# Altium schematic sheet Test_Points.SchDoc: Test Points
size A4; DocumentNumber: 22; SheetNumber: 22; SheetTotal: 51
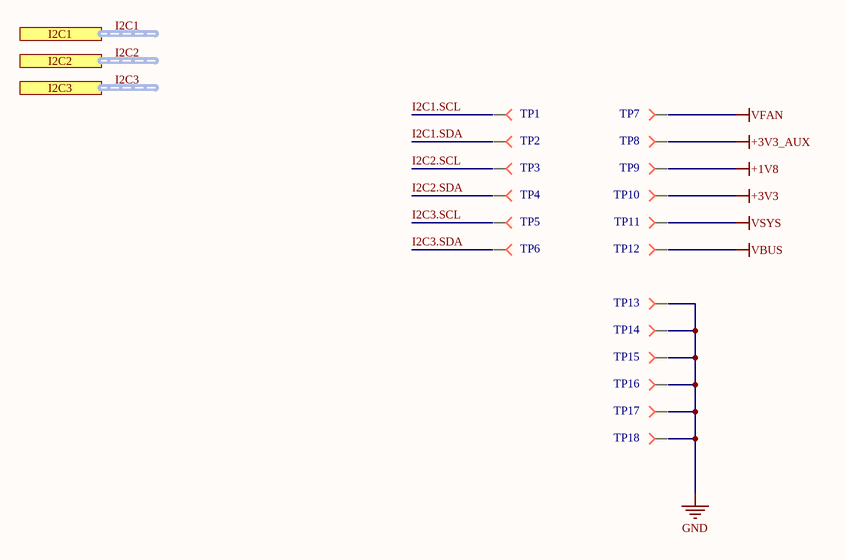
[diagram p0: Test_Points.SchDoc]

## Parts
TP1  Test Point Pad  [Testpoint]  (value not drawn)  (no BOM)
TP2  Test Point Pad  [Testpoint]  (value not drawn)  (no BOM)
TP3  Test Point Pad  [Testpoint]  (value not drawn)  (no BOM)
TP4  Test Point Pad  [Testpoint]  (value not drawn)  (no BOM)
TP5  Test Point Pad  [Testpoint]  (value not drawn)  (no BOM)
TP6  Test Point Pad  [Testpoint]  (value not drawn)  (no BOM)
TP7  Test Point Pad  [Testpoint]  (value not drawn)  (no BOM)
TP8  Test Point Pad  [Testpoint]  (value not drawn)  (no BOM)
TP9  Test Point Pad  [Testpoint]  (value not drawn)  (no BOM)
TP10  Test Point Pad  [Testpoint]  (value not drawn)  (no BOM)
TP11  Test Point Pad  [Testpoint]  (value not drawn)  (no BOM)
TP12  Test Point Pad  [Testpoint]  (value not drawn)  (no BOM)
TP13  Test Point Pad  [Testpoint]  (value not drawn)  (no BOM)
TP14  Test Point Pad  [Testpoint]  (value not drawn)  (no BOM)
TP15  Test Point Pad  [Testpoint]  (value not drawn)  (no BOM)
TP16  Test Point Pad  [Testpoint]  (value not drawn)  (no BOM)
TP17  Test Point Pad  [Testpoint]  (value not drawn)  (no BOM)
TP18  Test Point Pad  [Testpoint]  (value not drawn)  (no BOM)

## Ports
I2C1 (harness I2C), I2C2 (harness I2C), I2C3 (harness I2C)

## Nets
+1V8: TP9.1
+3V3: TP10.1
+3V3_AUX: TP8.1
GND: TP13.1 TP14.1 TP15.1 TP16.1 TP17.1 TP18.1
VBUS: TP12.1
VFAN: TP7.1
VSYS: TP11.1
I2C1.SCL: TP1.1
I2C1.SDA: TP2.1
I2C2.SCL: TP3.1
I2C2.SDA: TP4.1
I2C3.SCL: TP5.1
I2C3.SDA: TP6.1

## Buses and harness runs
harness I2C1 = port I2C1
harness I2C2 = port I2C2
harness I2C3 = port I2C3

## Notes on the sheet
- Title
- Size:
- Date:
- A4
- Number:
- Time:
- Revision:
- Sheet
- of
- File:

## Library data of the parts
TP1-TP18 = Test Point Pad: Test Point. There is nothing to buy or mount.; ClassName: TestPoint; CompType: TestPoint; Manufacturer: N/A; MountType: N/A; PackageReference: TetsPoint; PartNumber: N/A